# Altium schematic sheet eMMC.SchDoc
size A3; Author: Nguyễn Hữu Thắng; DrawnBy: Nguyễn Hữu Thắng; SheetNumber: 17; SheetTotal: 36
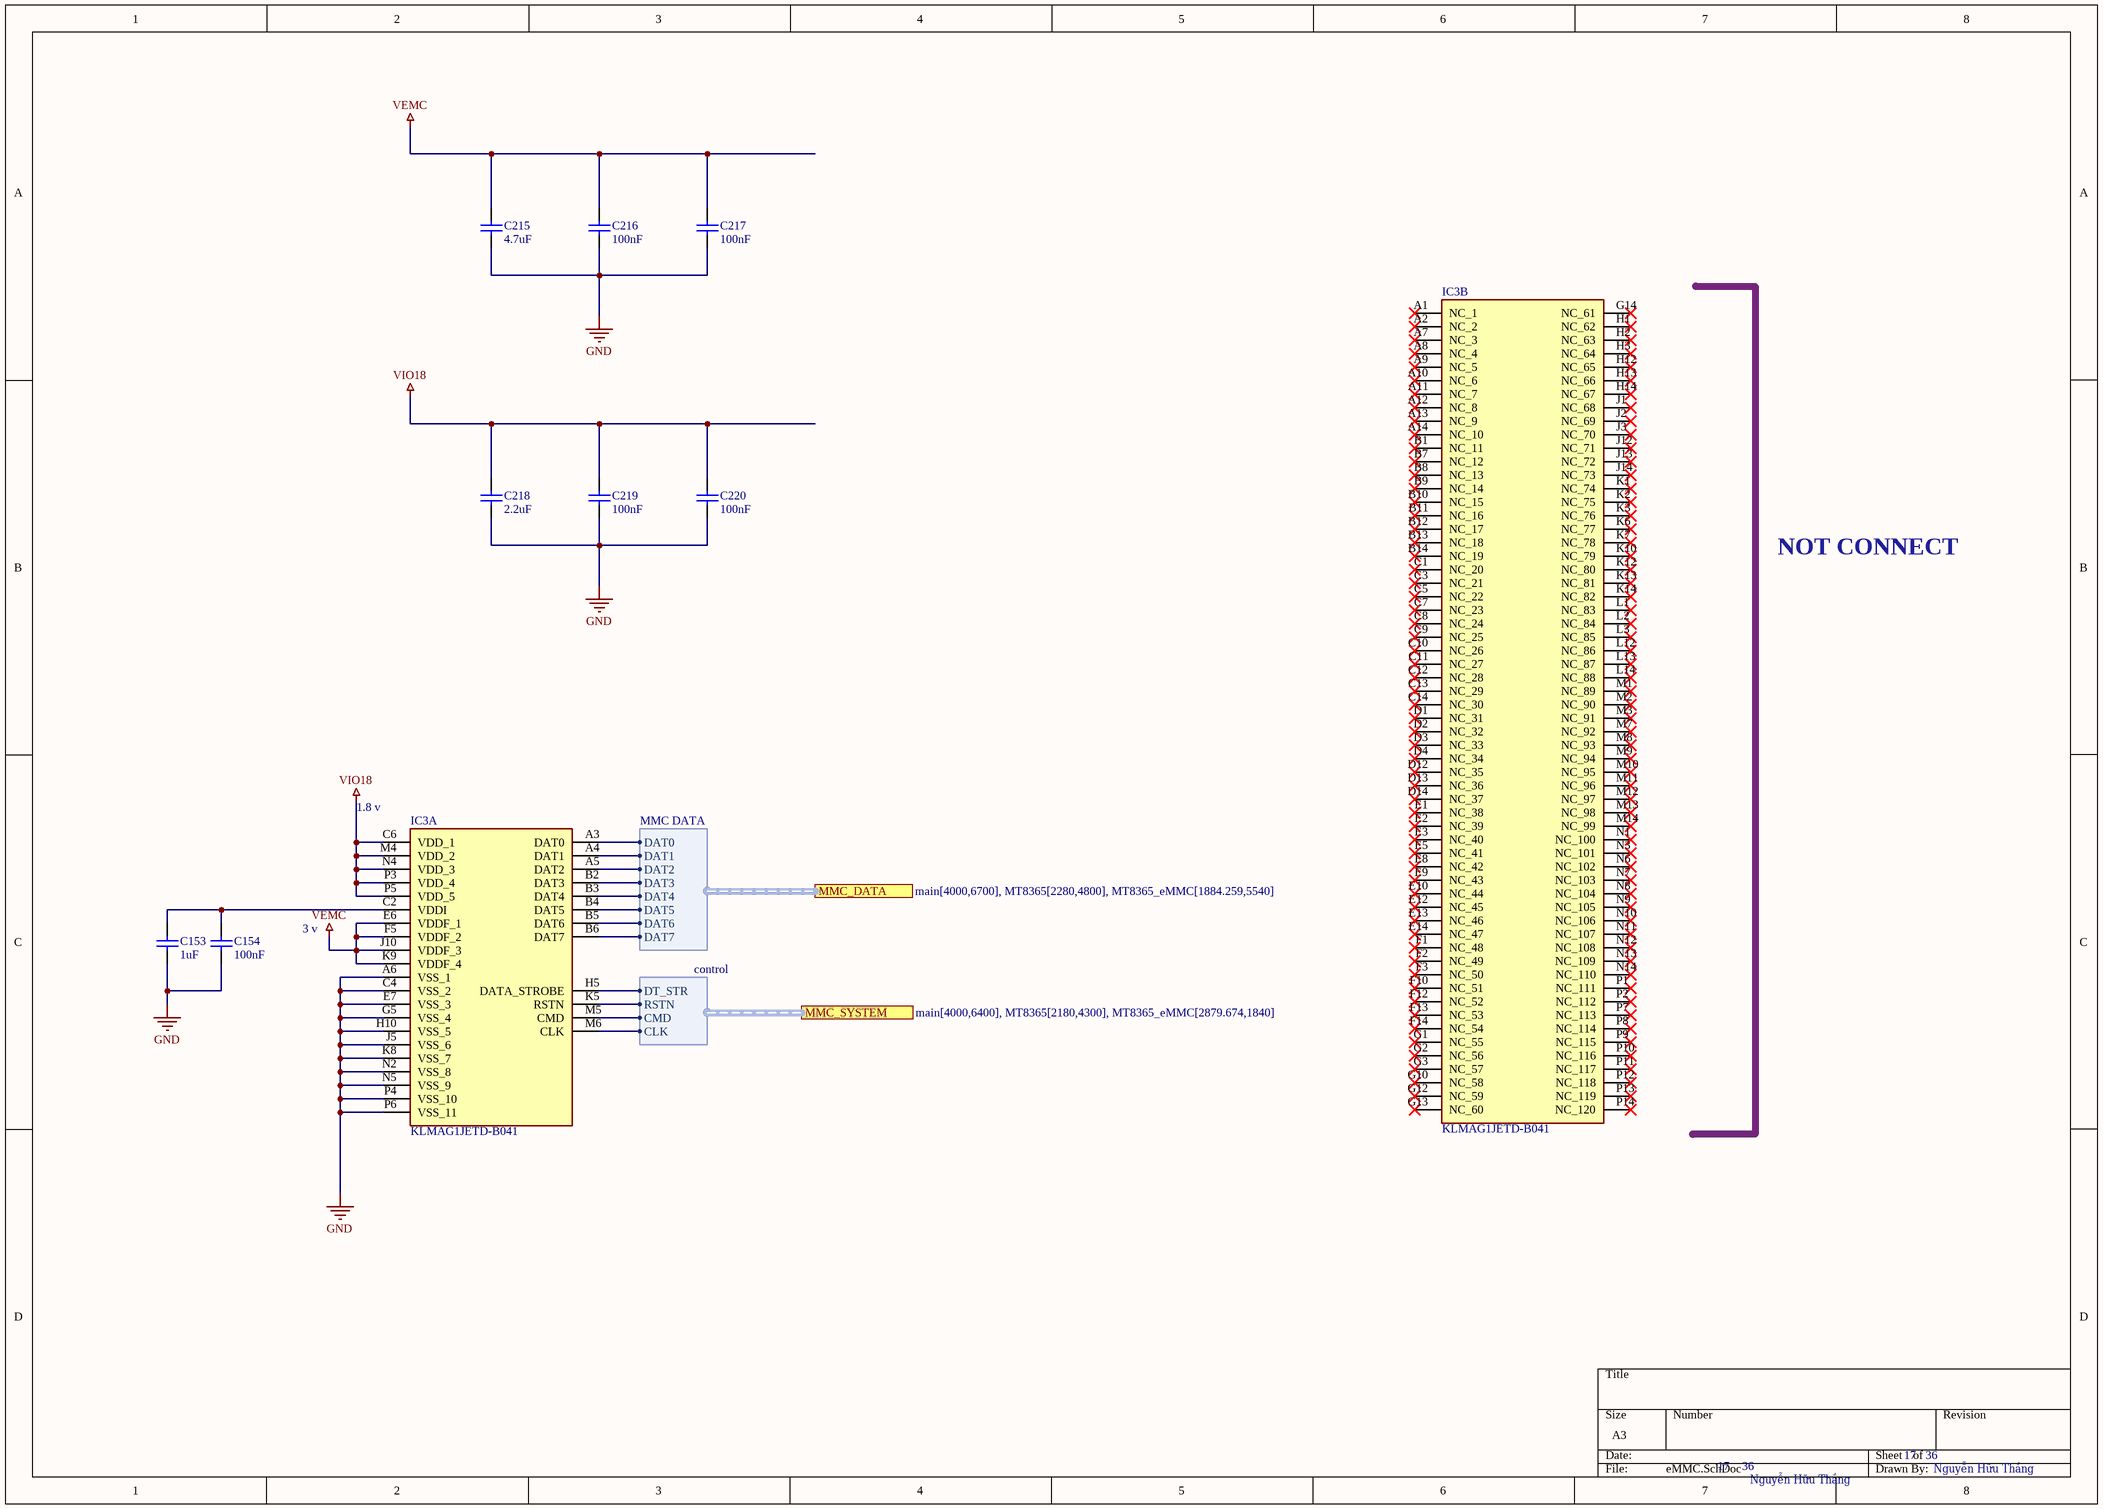
[diagram p0: eMMC.SchDoc]

## Parts
C153  value 1uF  [C0805]  (hidden comment: C0805)
C154  value 100nF  [C0603]  (hidden comment: C0603)
C215  value 4.7uF  [C0805]  (hidden comment: C0805)
C216  value 100nF  [C0603]  (hidden comment: C0603)
C217  value 100nF  [C0603]  (hidden comment: C0603)
C218  value 2.2uF  [C0805]  (hidden comment: C0805)
C219  value 100nF  [C0603]  (hidden comment: C0603)
C220  value 100nF  [C0603]  (hidden comment: C0603)
IC3  KLMAG1JETD-B041  [BGA153C50P14X14_1150X1300X80]  (parts A,B of 2)

## Ports
MMC_DATA (harness MMC DATA, see main[4000,6700], MT8365[2280,4800], MT8365_eMMC[1884.259,5540]), MMC_SYSTEM (harness control, see main[4000,6400], MT8365[2180,4300], MT8365_eMMC[2879.674,1840])

## Harnesses
MMC DATA: DAT0, DAT1, DAT2, DAT3, DAT4, DAT5, DAT6, DAT7
control: DT_STR, RSTN, CMD, CLK

## Nets
GND: C153.1 C154.1 C215.1 C216.1 C217.1 C218.1 C219.1 C220.1 IC3.A6(VSS_1) IC3.C4(VSS_2) IC3.E7(VSS_3) IC3.G5(VSS_4) IC3.H10(VSS_5) IC3.J5(VSS_6) IC3.K8(VSS_7) IC3.N2(VSS_8) IC3.N5(VSS_9) IC3.P4(VSS_10) IC3.P6(VSS_11)
VEMC: C215.2 C216.2 C217.2 IC3.E6(VDDF_1) IC3.F5(VDDF_2) IC3.J10(VDDF_3) IC3.K9(VDDF_4)
VIO18: C218.2 C219.2 C220.2 IC3.C6(VDD_1) IC3.M4(VDD_2) IC3.N4(VDD_3) IC3.P3(VDD_4) IC3.P5(VDD_5)
NetC153_2: C153.2 C154.2 IC3.C2(VDDI)
NetIC3_A3: IC3.A3(DAT0) ; port MMC_DATA.DAT0
NetIC3_A4: IC3.A4(DAT1) ; port MMC_DATA.DAT1
NetIC3_A5: IC3.A5(DAT2) ; port MMC_DATA.DAT2
NetIC3_B2: IC3.B2(DAT3) ; port MMC_DATA.DAT3
NetIC3_B3: IC3.B3(DAT4) ; port MMC_DATA.DAT4
NetIC3_B4: IC3.B4(DAT5) ; port MMC_DATA.DAT5
NetIC3_B5: IC3.B5(DAT6) ; port MMC_DATA.DAT6
NetIC3_B6: IC3.B6(DAT7) ; port MMC_DATA.DAT7
NetIC3_H5: IC3.H5(DATA_STROBE) ; port MMC_SYSTEM.DT_STR
NetIC3_K5: IC3.K5(RSTN) ; port MMC_SYSTEM.RSTN
NetIC3_M5: IC3.M5(CMD) ; port MMC_SYSTEM.CMD
NetIC3_M6: IC3.M6(CLK) ; port MMC_SYSTEM.CLK

Not connected (* = marked no-connect by the designer): IC3 A1(NC_1)* A2(NC_2)* A7(NC_3)* A8(NC_4)* A9(NC_5)* A10(NC_6)* A11(NC_7)* A12(NC_8)* A13(NC_9)* A14(NC_10)* B1(NC_11)* B7(NC_12)* B8(NC_13)* B9(NC_14)* B10(NC_15)* B11(NC_16)* B12(NC_17)* B13(NC_18)* B14(NC_19)* C1(NC_20)* C3(NC_21)* C5(NC_22)* C7(NC_23)* C8(NC_24)* C9(NC_25)* C10(NC_26)* C11(NC_27)* C12(NC_28)* C13(NC_29)* C14(NC_30)* D1(NC_31)* D2(NC_32)* D3(NC_33)* D4(NC_34)* D12(NC_35)* D13(NC_36)* D14(NC_37)* E1(NC_38)* E2(NC_39)* E3(NC_40)* E5(NC_41)* E8(NC_42)* E9(NC_43)* E10(NC_44)* E12(NC_45)* E13(NC_46)* E14(NC_47)* F1(NC_48)* F2(NC_49)* F3(NC_50)* F10(NC_51)* F12(NC_52)* F13(NC_53)* F14(NC_54)* G1(NC_55)* G2(NC_56)* G3(NC_57)* G10(NC_58)* G12(NC_59)* G13(NC_60)* G14(NC_61)* H1(NC_62)* H2(NC_63)* H3(NC_64)* H12(NC_65)* H13(NC_66)* H14(NC_67)* J1(NC_68)* J2(NC_69)* J3(NC_70)* J12(NC_71)* J13(NC_72)* J14(NC_73)* K1(NC_74)* K2(NC_75)* K3(NC_76)* K6(NC_77)* K7(NC_78)* K10(NC_79)* K12(NC_80)* K13(NC_81)* K14(NC_82)* L1(NC_83)* L2(NC_84)* L3(NC_85)* L12(NC_86)* L13(NC_87)* L14(NC_88)* M1(NC_89)* M2(NC_90)* M3(NC_91)* M7(NC_92)* M8(NC_93)* M9(NC_94)* M10(NC_95)* M11(NC_96)* M12(NC_97)* M13(NC_98)* M14(NC_99)* N1(NC_100)* N3(NC_101)* N6(NC_102)* N7(NC_103)* N8(NC_104)* N9(NC_105)* N10(NC_106)* N11(NC_107)* N12(NC_108)* N13(NC_109)* N14(NC_110)* P1(NC_111)* P2(NC_112)* P7(NC_113)* P8(NC_114)* P9(NC_115)* P10(NC_116)* P11(NC_117)* P12(NC_118)* P13(NC_119)* P14(NC_120)*

## Notes on the sheet
- NOT CONNECT
- (near IC3) 1.8 v
- 3 v

## Library data of the parts
IC3 = KLMAG1JETD-B041: Integrated Circuit; Manufacturer_Name: SAMSUNG; Datasheet Link: https://datasheet.lcsc.com/lcsc/2007011825_Samsung-KLMAG1JETD-B041_C499919.pdf; Height: 0.8mm; Manufacturer_Part_Number: KLMAG1JETD-B041